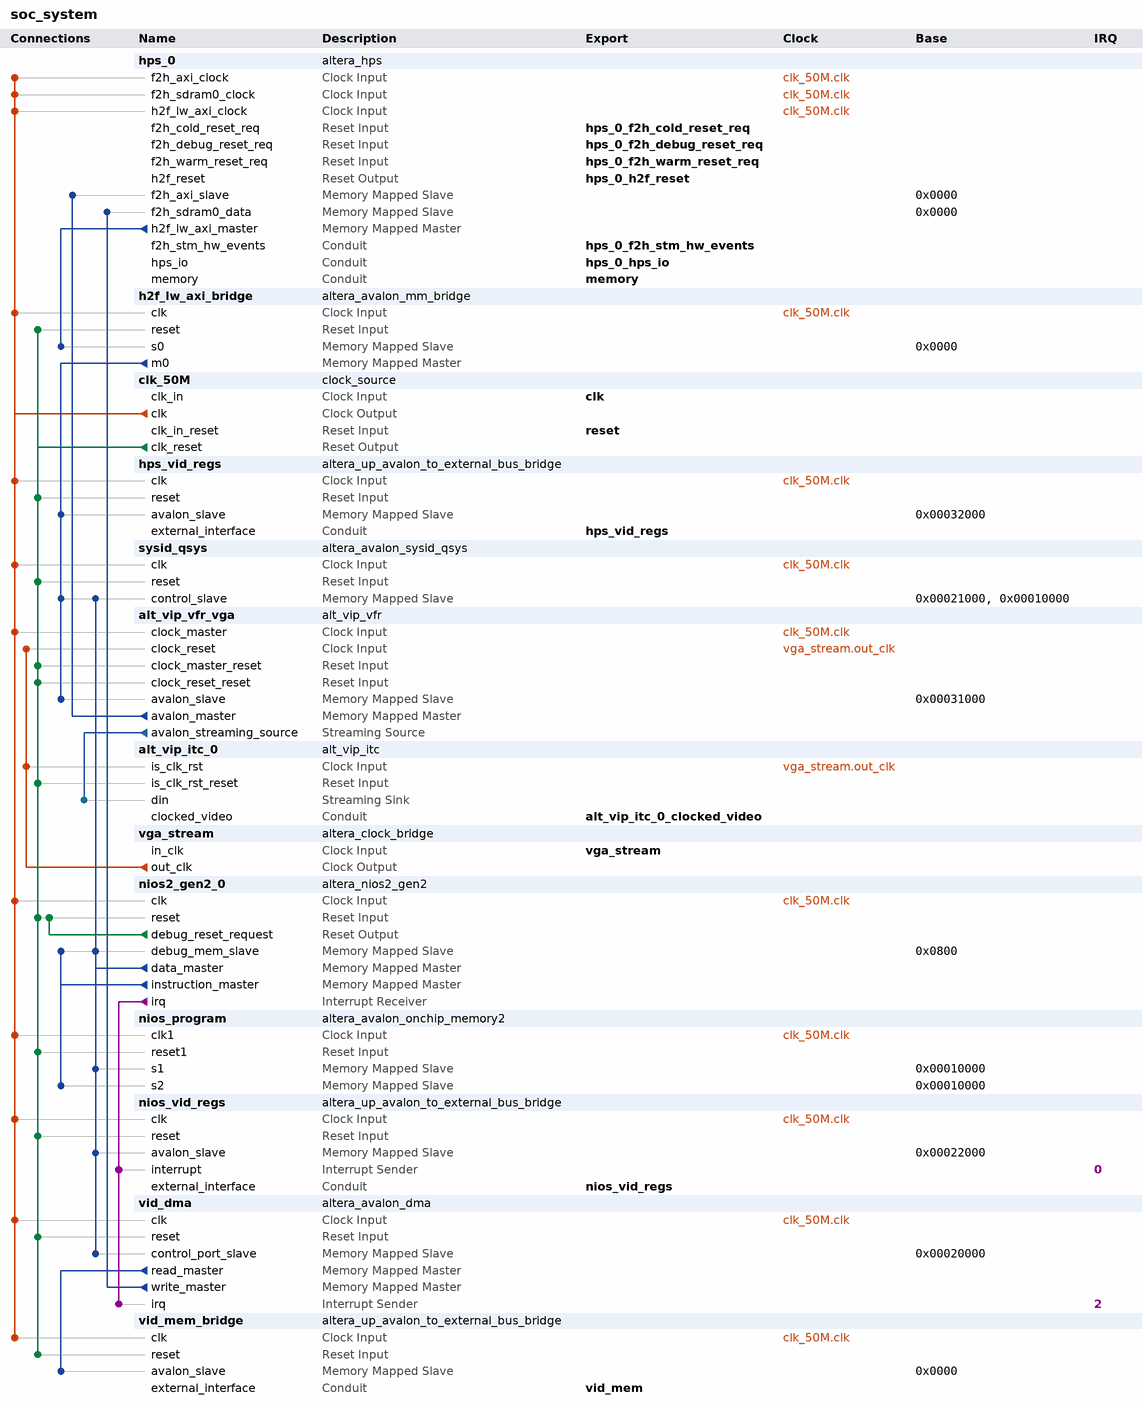
[diagram p0: system contents]
# Platform Designer (Qsys) system soc_system, Cyclone V 5CSXFC6D6F31C6
# Parameters at their usual value, and those the tool derives, are not listed.
package require -exact qsys 18.1
create_system soc_system
set_project_property DEVICE_FAMILY {Cyclone V}
set_project_property DEVICE 5CSXFC6D6F31C6

add_instance hps_0 altera_hps 18.1
set_instance_parameter_value hps_0 EMAC1_Mode RGMII
set_instance_parameter_value hps_0 EMAC1_PinMuxing {HPS I/O Set 0}
set_instance_parameter_value hps_0 F2SCLK_COLDRST_Enable true
set_instance_parameter_value hps_0 F2SCLK_DBGRST_Enable true
set_instance_parameter_value hps_0 F2SCLK_WARMRST_Enable true
set_instance_parameter_value hps_0 F2SDRAM_Type {Avalon-MM Write-Only}
set_instance_parameter_value hps_0 F2SDRAM_Width 64
set_instance_parameter_value hps_0 F2SINTERRUPT_Enable false
set_instance_parameter_value hps_0 F2S_Width 3
set_instance_parameter_value hps_0 FPGA_PERIPHERAL_OUTPUT_CLOCK_FREQ_EMAC0_GTX_CLK 100
set_instance_parameter_value hps_0 FPGA_PERIPHERAL_OUTPUT_CLOCK_FREQ_EMAC0_MD_CLK 100.0
set_instance_parameter_value hps_0 FPGA_PERIPHERAL_OUTPUT_CLOCK_FREQ_EMAC1_GTX_CLK 100
set_instance_parameter_value hps_0 FPGA_PERIPHERAL_OUTPUT_CLOCK_FREQ_EMAC1_MD_CLK 100.0
set_instance_parameter_value hps_0 HPS_PROTOCOL DDR3
set_instance_parameter_value hps_0 I2C0_Mode I2C
set_instance_parameter_value hps_0 I2C0_PinMuxing {HPS I/O Set 0}
set_instance_parameter_value hps_0 I2C1_Mode I2C
set_instance_parameter_value hps_0 I2C1_PinMuxing {HPS I/O Set 0}
set_instance_parameter_value hps_0 LWH2F_Enable true
set_instance_parameter_value hps_0 MEM_BANKADDR_WIDTH 3
set_instance_parameter_value hps_0 MEM_CLK_FREQ 400.0
set_instance_parameter_value hps_0 MEM_COL_ADDR_WIDTH 10
set_instance_parameter_value hps_0 MEM_DQ_WIDTH 32
set_instance_parameter_value hps_0 MEM_DRV_STR RZQ/6
set_instance_parameter_value hps_0 MEM_ROW_ADDR_WIDTH 15
set_instance_parameter_value hps_0 MEM_RTT_NOM RZQ/6
set_instance_parameter_value hps_0 MEM_RTT_WR {Dynamic ODT off}
set_instance_parameter_value hps_0 MEM_TCL 7
set_instance_parameter_value hps_0 MEM_TFAW_NS 45.0
set_instance_parameter_value hps_0 MEM_TRAS_NS 36.0
set_instance_parameter_value hps_0 MEM_TRCD_NS 13.125
set_instance_parameter_value hps_0 MEM_TRFC_NS 300.0
set_instance_parameter_value hps_0 MEM_TRP_NS 13.125
set_instance_parameter_value hps_0 MEM_VENDOR Micron
set_instance_parameter_value hps_0 MEM_WTCL 7
set_instance_parameter_value hps_0 QSPI_Mode {1 SS}
set_instance_parameter_value hps_0 QSPI_PinMuxing {HPS I/O Set 0}
set_instance_parameter_value hps_0 REF_CLK_FREQ 25.0
set_instance_parameter_value hps_0 S2FCLK_USER2CLK 1
set_instance_parameter_value hps_0 S2F_Width 0
set_instance_parameter_value hps_0 SDIO_Mode {4-bit Data}
set_instance_parameter_value hps_0 SDIO_PinMuxing {HPS I/O Set 0}
set_instance_parameter_value hps_0 SPIM0_Mode {Single Slave Select}
set_instance_parameter_value hps_0 SPIM0_PinMuxing {HPS I/O Set 0}
set_instance_parameter_value hps_0 SPIM1_Mode {Single Slave Select}
set_instance_parameter_value hps_0 SPIM1_PinMuxing {HPS I/O Set 0}
set_instance_parameter_value hps_0 STM_Enable true
set_instance_parameter_value hps_0 TIMING_BOARD_AC_SKEW 0.02
set_instance_parameter_value hps_0 TIMING_BOARD_AC_TO_CK_SKEW 0.01
set_instance_parameter_value hps_0 TIMING_BOARD_DQ_TO_DQS_SKEW 0.05
set_instance_parameter_value hps_0 TIMING_BOARD_MAX_CK_DELAY 0.03
set_instance_parameter_value hps_0 TIMING_BOARD_MAX_DQS_DELAY 0.02
set_instance_parameter_value hps_0 TIMING_BOARD_SKEW_BETWEEN_DQS 0.06
set_instance_parameter_value hps_0 TIMING_BOARD_SKEW_CKDQS_DIMM_MAX 0.12
set_instance_parameter_value hps_0 TIMING_BOARD_SKEW_CKDQS_DIMM_MIN 0.06
set_instance_parameter_value hps_0 TIMING_BOARD_SKEW_WITHIN_DQS 0.01
set_instance_parameter_value hps_0 TIMING_TDH 65
set_instance_parameter_value hps_0 TIMING_TDQSCK 255
set_instance_parameter_value hps_0 TIMING_TDQSQ 125
set_instance_parameter_value hps_0 TIMING_TDS 30
set_instance_parameter_value hps_0 TIMING_TIH 140
set_instance_parameter_value hps_0 TIMING_TIS 190
set_instance_parameter_value hps_0 TIMING_TQSH 0.4
set_instance_parameter_value hps_0 UART0_Mode {No Flow Control}
set_instance_parameter_value hps_0 UART0_PinMuxing {HPS I/O Set 0}
set_instance_parameter_value hps_0 USB1_Mode SDR
set_instance_parameter_value hps_0 USB1_PinMuxing {HPS I/O Set 0}
set_instance_parameter_value hps_0 desired_cfg_clk_mhz 97.368421
set_instance_parameter_value hps_0 desired_mpu_clk_mhz 925.0
set_instance_parameter_value hps_0 desired_qspi_clk_mhz 370.0
set_instance_parameter_value hps_0 use_default_mpu_clk false

add_instance h2f_lw_axi_bridge altera_avalon_mm_bridge 18.1
set_instance_parameter_value h2f_lw_axi_bridge ADDRESS_UNITS SYMBOLS
set_instance_parameter_value h2f_lw_axi_bridge ADDRESS_WIDTH 10
set_instance_parameter_value h2f_lw_axi_bridge DATA_WIDTH 32
set_instance_parameter_value h2f_lw_axi_bridge MAX_PENDING_RESPONSES 4
set_instance_parameter_value h2f_lw_axi_bridge USE_AUTO_ADDRESS_WIDTH 1

add_instance clk_50M clock_source 18.1
set_instance_parameter_value clk_50M clockFrequency 50000000

add_instance hps_vid_regs altera_up_avalon_to_external_bus_bridge 18.0
set_instance_parameter_value hps_vid_regs addr_size 16
set_instance_parameter_value hps_vid_regs addr_size_multiplier bytes
set_instance_parameter_value hps_vid_regs data_size 32

add_instance sysid_qsys altera_avalon_sysid_qsys 18.1
set_instance_parameter_value sysid_qsys id -1395049680

add_instance alt_vip_vfr_vga alt_vip_vfr 14.0
set_instance_parameter_value alt_vip_vfr_vga MAX_IMAGE_WIDTH 1024
set_instance_parameter_value alt_vip_vfr_vga RMASTER_BURST_TARGET 16

add_instance alt_vip_itc_0 alt_vip_itc 14.0
set_instance_parameter_value alt_vip_itc_0 FIFO_DEPTH 1920
set_instance_parameter_value alt_vip_itc_0 H_ACTIVE_PIXELS 1024
set_instance_parameter_value alt_vip_itc_0 H_BACK_PORCH 160
set_instance_parameter_value alt_vip_itc_0 H_FRONT_PORCH 24
set_instance_parameter_value alt_vip_itc_0 H_SYNC_LENGTH 136
set_instance_parameter_value alt_vip_itc_0 NUMBER_OF_COLOUR_PLANES 4
set_instance_parameter_value alt_vip_itc_0 THRESHOLD 1919
set_instance_parameter_value alt_vip_itc_0 V_ACTIVE_LINES 768
set_instance_parameter_value alt_vip_itc_0 V_BACK_PORCH 29
set_instance_parameter_value alt_vip_itc_0 V_FRONT_PORCH 3
set_instance_parameter_value alt_vip_itc_0 V_SYNC_LENGTH 6

add_instance vga_stream altera_clock_bridge 18.1
set_instance_parameter_value vga_stream DERIVED_CLOCK_RATE 0
set_instance_parameter_value vga_stream EXPLICIT_CLOCK_RATE 0

add_instance nios2_gen2_0 altera_nios2_gen2 18.1
set_instance_parameter_value nios2_gen2_0 cpuID 3145733
set_instance_parameter_value nios2_gen2_0 dcache_size 2048
set_instance_parameter_value nios2_gen2_0 exceptionSlave nios_program.s2
set_instance_parameter_value nios2_gen2_0 icache_size 4096
set_instance_parameter_value nios2_gen2_0 impl Tiny
set_instance_parameter_value nios2_gen2_0 resetSlave nios_program.s2

add_instance nios_program altera_avalon_onchip_memory2 18.1
set_instance_parameter_value nios_program dataWidth 32
set_instance_parameter_value nios_program dualPort true
set_instance_parameter_value nios_program initMemContent true
set_instance_parameter_value nios_program initializationFileName software/camerica/mem_init/soc_system_nios_program.hex
set_instance_parameter_value nios_program memorySize 2048
set_instance_parameter_value nios_program singleClockOperation true
set_instance_parameter_value nios_program useNonDefaultInitFile true

add_instance nios_vid_regs altera_up_avalon_to_external_bus_bridge 18.0
set_instance_parameter_value nios_vid_regs addr_size 16
set_instance_parameter_value nios_vid_regs addr_size_multiplier bytes
set_instance_parameter_value nios_vid_regs data_size 32

add_instance vid_dma altera_avalon_dma 18.1
set_instance_parameter_value vid_dma allowByteTransactions false
set_instance_parameter_value vid_dma allowDoubleWordTransactions true
set_instance_parameter_value vid_dma allowHalfWordTransactions false
set_instance_parameter_value vid_dma allowQuadWordTransactions false
set_instance_parameter_value vid_dma allowWordTransactions false
set_instance_parameter_value vid_dma burstEnable false
set_instance_parameter_value vid_dma fifoDepth 8
set_instance_parameter_value vid_dma maxBurstSize 128
set_instance_parameter_value vid_dma minimumDmaTransactionRegisterWidth 12
set_instance_parameter_value vid_dma softresetEnable false

add_instance vid_mem_bridge altera_up_avalon_to_external_bus_bridge 18.0
set_instance_parameter_value vid_mem_bridge addr_size 8
set_instance_parameter_value vid_mem_bridge addr_size_multiplier Kbytes
set_instance_parameter_value vid_mem_bridge data_size 64

# connections
add_connection clk_50M.clk alt_vip_vfr_vga.clock_master clock
add_connection clk_50M.clk h2f_lw_axi_bridge.clk clock
add_connection clk_50M.clk hps_0.f2h_axi_clock clock
add_connection clk_50M.clk hps_0.f2h_sdram0_clock clock
add_connection clk_50M.clk hps_0.h2f_lw_axi_clock clock
add_connection clk_50M.clk hps_vid_regs.clk clock
add_connection clk_50M.clk nios2_gen2_0.clk clock
add_connection clk_50M.clk nios_program.clk1 clock
add_connection clk_50M.clk nios_vid_regs.clk clock
add_connection clk_50M.clk sysid_qsys.clk clock
add_connection clk_50M.clk vid_dma.clk clock
add_connection clk_50M.clk vid_mem_bridge.clk clock
add_connection vga_stream.out_clk alt_vip_itc_0.is_clk_rst clock
add_connection vga_stream.out_clk alt_vip_vfr_vga.clock_reset clock
add_connection clk_50M.clk_reset alt_vip_itc_0.is_clk_rst_reset reset
add_connection clk_50M.clk_reset alt_vip_vfr_vga.clock_master_reset reset
add_connection clk_50M.clk_reset alt_vip_vfr_vga.clock_reset_reset reset
add_connection clk_50M.clk_reset h2f_lw_axi_bridge.reset reset
add_connection clk_50M.clk_reset hps_vid_regs.reset reset
add_connection clk_50M.clk_reset nios2_gen2_0.reset reset
add_connection clk_50M.clk_reset nios_program.reset1 reset
add_connection clk_50M.clk_reset nios_vid_regs.reset reset
add_connection clk_50M.clk_reset sysid_qsys.reset reset
add_connection clk_50M.clk_reset vid_dma.reset reset
add_connection clk_50M.clk_reset vid_mem_bridge.reset reset
add_connection nios2_gen2_0.debug_reset_request nios2_gen2_0.reset reset
add_connection alt_vip_vfr_vga.avalon_master hps_0.f2h_axi_slave avalon
set_connection_parameter_value alt_vip_vfr_vga.avalon_master/hps_0.f2h_axi_slave baseAddress 0x0000
add_connection h2f_lw_axi_bridge.m0 alt_vip_vfr_vga.avalon_slave avalon
set_connection_parameter_value h2f_lw_axi_bridge.m0/alt_vip_vfr_vga.avalon_slave baseAddress 0x00031000
add_connection h2f_lw_axi_bridge.m0 hps_vid_regs.avalon_slave avalon
set_connection_parameter_value h2f_lw_axi_bridge.m0/hps_vid_regs.avalon_slave baseAddress 0x00032000
add_connection h2f_lw_axi_bridge.m0 sysid_qsys.control_slave avalon
set_connection_parameter_value h2f_lw_axi_bridge.m0/sysid_qsys.control_slave baseAddress 0x00010000
add_connection hps_0.h2f_lw_axi_master h2f_lw_axi_bridge.s0 avalon
set_connection_parameter_value hps_0.h2f_lw_axi_master/h2f_lw_axi_bridge.s0 baseAddress 0x0000
add_connection nios2_gen2_0.data_master nios2_gen2_0.debug_mem_slave avalon
set_connection_parameter_value nios2_gen2_0.data_master/nios2_gen2_0.debug_mem_slave baseAddress 0x0800
add_connection nios2_gen2_0.data_master nios_program.s1 avalon
set_connection_parameter_value nios2_gen2_0.data_master/nios_program.s1 baseAddress 0x00010000
add_connection nios2_gen2_0.data_master nios_vid_regs.avalon_slave avalon
set_connection_parameter_value nios2_gen2_0.data_master/nios_vid_regs.avalon_slave baseAddress 0x00022000
add_connection nios2_gen2_0.data_master sysid_qsys.control_slave avalon
set_connection_parameter_value nios2_gen2_0.data_master/sysid_qsys.control_slave baseAddress 0x00021000
add_connection nios2_gen2_0.data_master vid_dma.control_port_slave avalon
set_connection_parameter_value nios2_gen2_0.data_master/vid_dma.control_port_slave baseAddress 0x00020000
add_connection nios2_gen2_0.instruction_master nios2_gen2_0.debug_mem_slave avalon
set_connection_parameter_value nios2_gen2_0.instruction_master/nios2_gen2_0.debug_mem_slave baseAddress 0x0800
add_connection nios2_gen2_0.instruction_master nios_program.s2 avalon
set_connection_parameter_value nios2_gen2_0.instruction_master/nios_program.s2 baseAddress 0x00010000
add_connection vid_dma.read_master vid_mem_bridge.avalon_slave avalon
set_connection_parameter_value vid_dma.read_master/vid_mem_bridge.avalon_slave baseAddress 0x0000
add_connection vid_dma.write_master hps_0.f2h_sdram0_data avalon
set_connection_parameter_value vid_dma.write_master/hps_0.f2h_sdram0_data baseAddress 0x0000
add_connection alt_vip_vfr_vga.avalon_streaming_source alt_vip_itc_0.din avalon_streaming
add_connection nios2_gen2_0.irq nios_vid_regs.interrupt interrupt
set_connection_parameter_value nios2_gen2_0.irq/nios_vid_regs.interrupt irqNumber 0
add_connection nios2_gen2_0.irq vid_dma.irq interrupt
set_connection_parameter_value nios2_gen2_0.irq/vid_dma.irq irqNumber 2

# exported interfaces
add_interface alt_vip_itc_0_clocked_video conduit end
set_interface_property alt_vip_itc_0_clocked_video EXPORT_OF alt_vip_itc_0.clocked_video
add_interface clk clock sink
set_interface_property clk EXPORT_OF clk_50M.clk_in
add_interface hps_0_f2h_cold_reset_req reset sink
set_interface_property hps_0_f2h_cold_reset_req EXPORT_OF hps_0.f2h_cold_reset_req
add_interface hps_0_f2h_debug_reset_req reset sink
set_interface_property hps_0_f2h_debug_reset_req EXPORT_OF hps_0.f2h_debug_reset_req
add_interface hps_0_f2h_stm_hw_events conduit end
set_interface_property hps_0_f2h_stm_hw_events EXPORT_OF hps_0.f2h_stm_hw_events
add_interface hps_0_f2h_warm_reset_req reset sink
set_interface_property hps_0_f2h_warm_reset_req EXPORT_OF hps_0.f2h_warm_reset_req
add_interface hps_0_h2f_reset reset source
set_interface_property hps_0_h2f_reset EXPORT_OF hps_0.h2f_reset
add_interface hps_0_hps_io conduit end
set_interface_property hps_0_hps_io EXPORT_OF hps_0.hps_io
add_interface hps_vid_regs conduit end
set_interface_property hps_vid_regs EXPORT_OF hps_vid_regs.external_interface
add_interface memory conduit end
set_interface_property memory EXPORT_OF hps_0.memory
add_interface nios_vid_regs conduit end
set_interface_property nios_vid_regs EXPORT_OF nios_vid_regs.external_interface
add_interface reset reset sink
set_interface_property reset EXPORT_OF clk_50M.clk_in_reset
add_interface vga_stream clock sink
set_interface_property vga_stream EXPORT_OF vga_stream.in_clk
add_interface vid_mem conduit end
set_interface_property vid_mem EXPORT_OF vid_mem_bridge.external_interface

set_interconnect_requirement {$system} qsys_mm.clockCrossingAdapter HANDSHAKE
set_interconnect_requirement {$system} qsys_mm.maxAdditionalLatency 1

save_system soc_system.qsys
